# EAGLE design BSS138LevelShift (EAGLE 7.5.0)
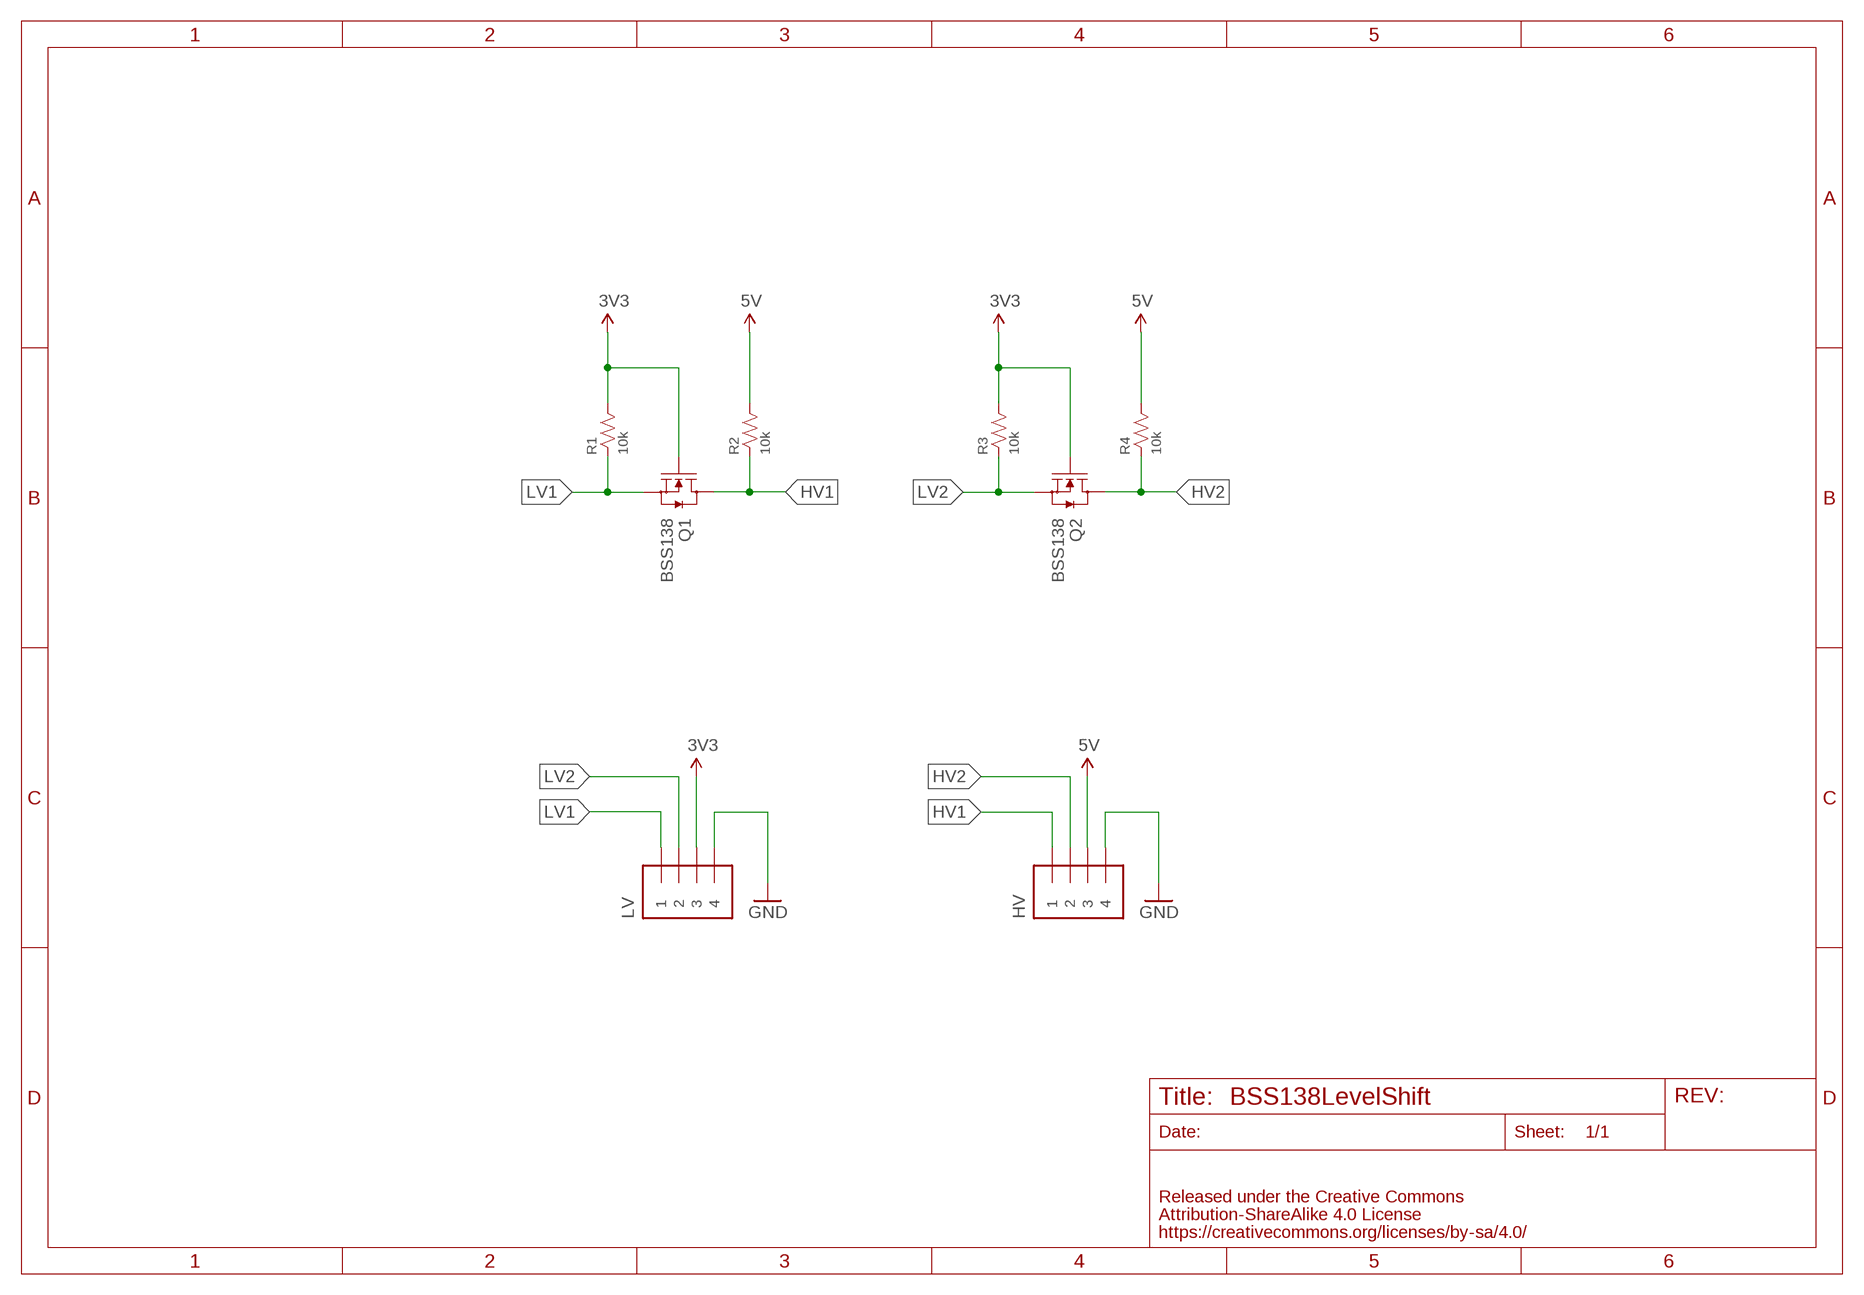
[diagram p0: schematic, sheet 1]

## Parts
HV  PIN_HEADER_1X4  [PIN_1X4_SNEAKY]
LV  PIN_HEADER_1X4  [PIN_1X4_SNEAKY]
Q1  BSS138  MOSFET-N-BSS138  [SOT23-3]
Q2  BSS138  MOSFET-N-BSS138  [SOT23-3]
R1  10k  RESISTOR-0603  [0603]
R2  10k  RESISTOR-0603  [0603]
R3  10k  RESISTOR-0603  [0603]
R4  10k  RESISTOR-0603  [0603]

## Nets
3V3: LV.3 Q1.1(G) Q2.1(G) R1.2 R3.2
5V: HV.3 R2.2 R4.2
GND: HV.4 LV.4
HV1: HV.1 Q1.3(D) R2.1
HV2: HV.2 Q2.3(D) R4.1
LV1: LV.1 Q1.2(S) R1.1
LV2: LV.2 Q2.2(S) R3.1

## Library data of the parts
HV LV = FaBo-PIN:PIN_HEADER_1X4
Q1 Q2 = FaBo-etc:MOSFET-N
R1-R4 = FaBo-Resistors:RESISTOR: RESISTOR

## Board
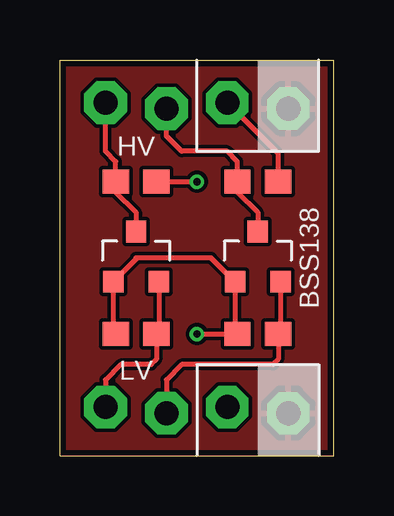
[diagram p1: board, top side]
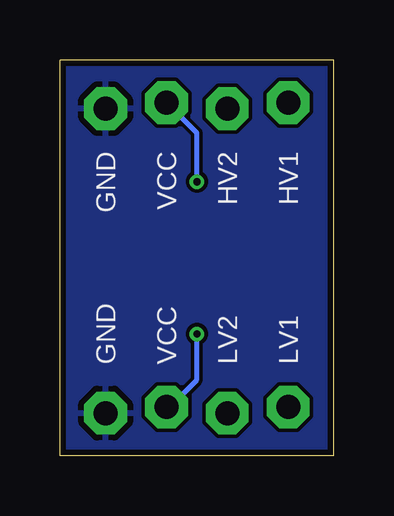
[diagram p2: board, bottom side, seen from below]

Size 11.43 x 16.51 mm. Coordinates in mm from the lower left corner, seen from the top.
Outline: 0,0 11.43,0 11.43,16.51 0,16.51 0,0
Copper layers (1*16): Top 0.035mm / dielectric 1.5mm / Bottom 0.035mm
Design rules "Elecrow_2-layer_eagle_rule": minimum track width 6mil, minimum drill 12mil, track to track 6mil, track to pad 6mil, pad to pad 6mil, via to via 6mil, smd to smd 0mil, copper to edge 10mil, drill to drill 10mil, minimum pad ring 10mil, minimum via ring 6mil, stop-mask expansion 2mil, vias tented up to drill 100mil, thermal gap 10mil

### Footprints (pad centres in the part's own frame; a part is rotated, then mirrored left to right if it is on the bottom)
PIN_1X4_SNEAKY = drill 1 pad 1.778 octagon: 1 -3.81,0.127; 2 -1.27,-0.127; 3 1.27,0.127; 4 3.81,-0.127
SOT23-3 = smd 0.85 x 0.9: 1 -0.95,-1; 2 0.95,-1; 3 0,1.1
0603 = smd 1.1 x 1: 1 -0.85,0; 2 0.85,0

### Placement (x,y rotation side)
HV  5.71,14.61 0 top
LV  5.71,1.91 0 top
Q1  3.17,8.26 0 top
Q2  8.26,8.26 0 top
R1  3.17,5.08 180 top
R2  3.17,11.43 0 top
R3  8.26,5.08 180 top
R4  8.26,11.43 0 top

### Tracks (layer width: path | path; a pad name or v marks a point on that pad's centre or on a via)
3V3  (via drill 0.3)
  Top 0.203: R1.2 2.23,5.18 Q1.1 3.17,8.21 3.17,8.26 6.3,8.26 Q2.1 7.3,5.18 R3.2 v5.71,5.08
  Bottom 0.203: LV.3 6.86,2.03 5.71,3.17 v5.71,5.08
5V  (via drill 0.3)
  Top 0.203: R4.2 9.11,12.61 HV.3 | R2.2 v5.71,11.43
  Bottom 0.203: v5.71,11.43 5.71,13.46 HV.3
GND
  pour Bottom: -1.27,-1.27 12.7,-1.27 12.7,17.78 -1.27,17.78
  pour Top: -1.27,-1.27 12.7,-1.27 12.7,17.78 -1.27,17.78
HV1
  Top 0.203: HV.1 1.91,12.7 2.33,12.28 R2.1 2.33,11.01 3.17,10.16 Q1.3
HV2
  Top 0.203: HV.2 4.45,13.34 5.08,12.7 6.99,12.7 7.41,12.28 R4.1 7.41,11.01 8.26,10.16 Q2.3
LV1
  Top 0.203: Q1.2 4.12,5.18 R1.1 4.03,4.03 3.81,3.81 2.54,3.81 1.91,3.17 LV.1
LV2
  Top 0.203: Q2.2 9.21,5.18 R3.1 9.11,4.03 8.89,3.81 5.08,3.81 4.45,3.17 LV.2

### Text on the board
tPlace: BSS138
bPlace: HV1 | HV2 | VCC | GND | LV1 | LV2 | VCC | GND